# Altium schematic sheet IOT_Masterv2_301115_Comunication.SchDoc
size A
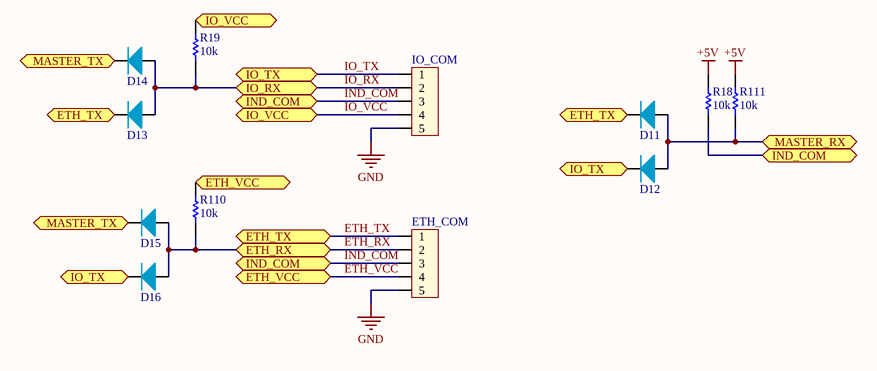
[diagram p0: IOT_Masterv2_301115_Comunication.SchDoc]

## Parts
D11  Diode  [DO-214AC]  (value not drawn)
D12  Diode  [DO-214AC]  (value not drawn)
D13  Diode  [DO-214AC]  (value not drawn)
D14  Diode  [DO-214AC]  (value not drawn)
D15  Diode  [DO-214AC]  (value not drawn)
D16  Diode  [DO-214AC]  (value not drawn)
ETH_COM  JP5  [CON5]  (value not drawn)
IO_COM  JP5  [CON5]  (value not drawn)
R18  value 10k  [RESC2012N_F]  (hidden comment: Res)
R19  value 10k  [RESC2012N_F]  (hidden comment: Res)
R110  value 10k  [RESC2012N_F]  (hidden comment: Res)
R111  value 10k  [RESC2012N_F]  (hidden comment: Res)

## Ports
ETH_RX, ETH_TX, ETH_VCC, IND_COM, IO_RX, IO_TX, IO_VCC, MASTER_RX, MASTER_TX

## Nets
+5V: R18.2 R111.2
GND: ETH_COM.5 IO_COM.5
ETH_RX: D15.1(A) D16.1(A) ETH_COM.2 R110.1 ; port ETH_RX
ETH_TX: D11.2(K) D13.2(K) ETH_COM.1 ; port ETH_TX
ETH_VCC: ETH_COM.4 R110.2 ; port ETH_VCC
IND_COM: ETH_COM.3 IO_COM.3 R18.1 ; port IND_COM
IO_RX: D13.1(A) D14.1(A) IO_COM.2 R19.1 ; port IO_RX
IO_TX: D12.2(K) D16.2(K) IO_COM.1 ; port IO_TX
IO_VCC: IO_COM.4 R19.2 ; port IO_VCC
MASTER_RX: D11.1(A) D12.1(A) R111.1 ; port MASTER_RX
MASTER_TX: D14.2(K) D15.2(K) ; port MASTER_TX

## Library data of the parts
D11-D16 = Diode: pin to pad: 1>A 2>K
ETH_COM IO_COM = Con5: Connector 5; Value: Connector 5